# Altium schematic sheet USB_Host_Hub.SchDoc: USB Host HUB
size A3; Project: STM32MP15-DISCO PI; Date: Not used; ApprovedBy: Not used; CheckedBy: Not used; Author: Not used; CompanyName: STMicroelectronics; DrawnBy: Not used; Engineer: Not used; Organization: Not used; Address1: Not used; Address2: Not used; Address3: Not used; Address4: Not used; DocumentNumber: 12; Revision: Not used; SheetNumber: 12; SheetTotal: 17; CurrentTime: Not used; CurrentDate: Not used; Time: Not used; DocumentFullPathAndName: Not used; DocumentName: Not used; ModifiedDate: Not used; ImagePath: Not used; ProjectName: Not used; Application_BuildNumber: Not used
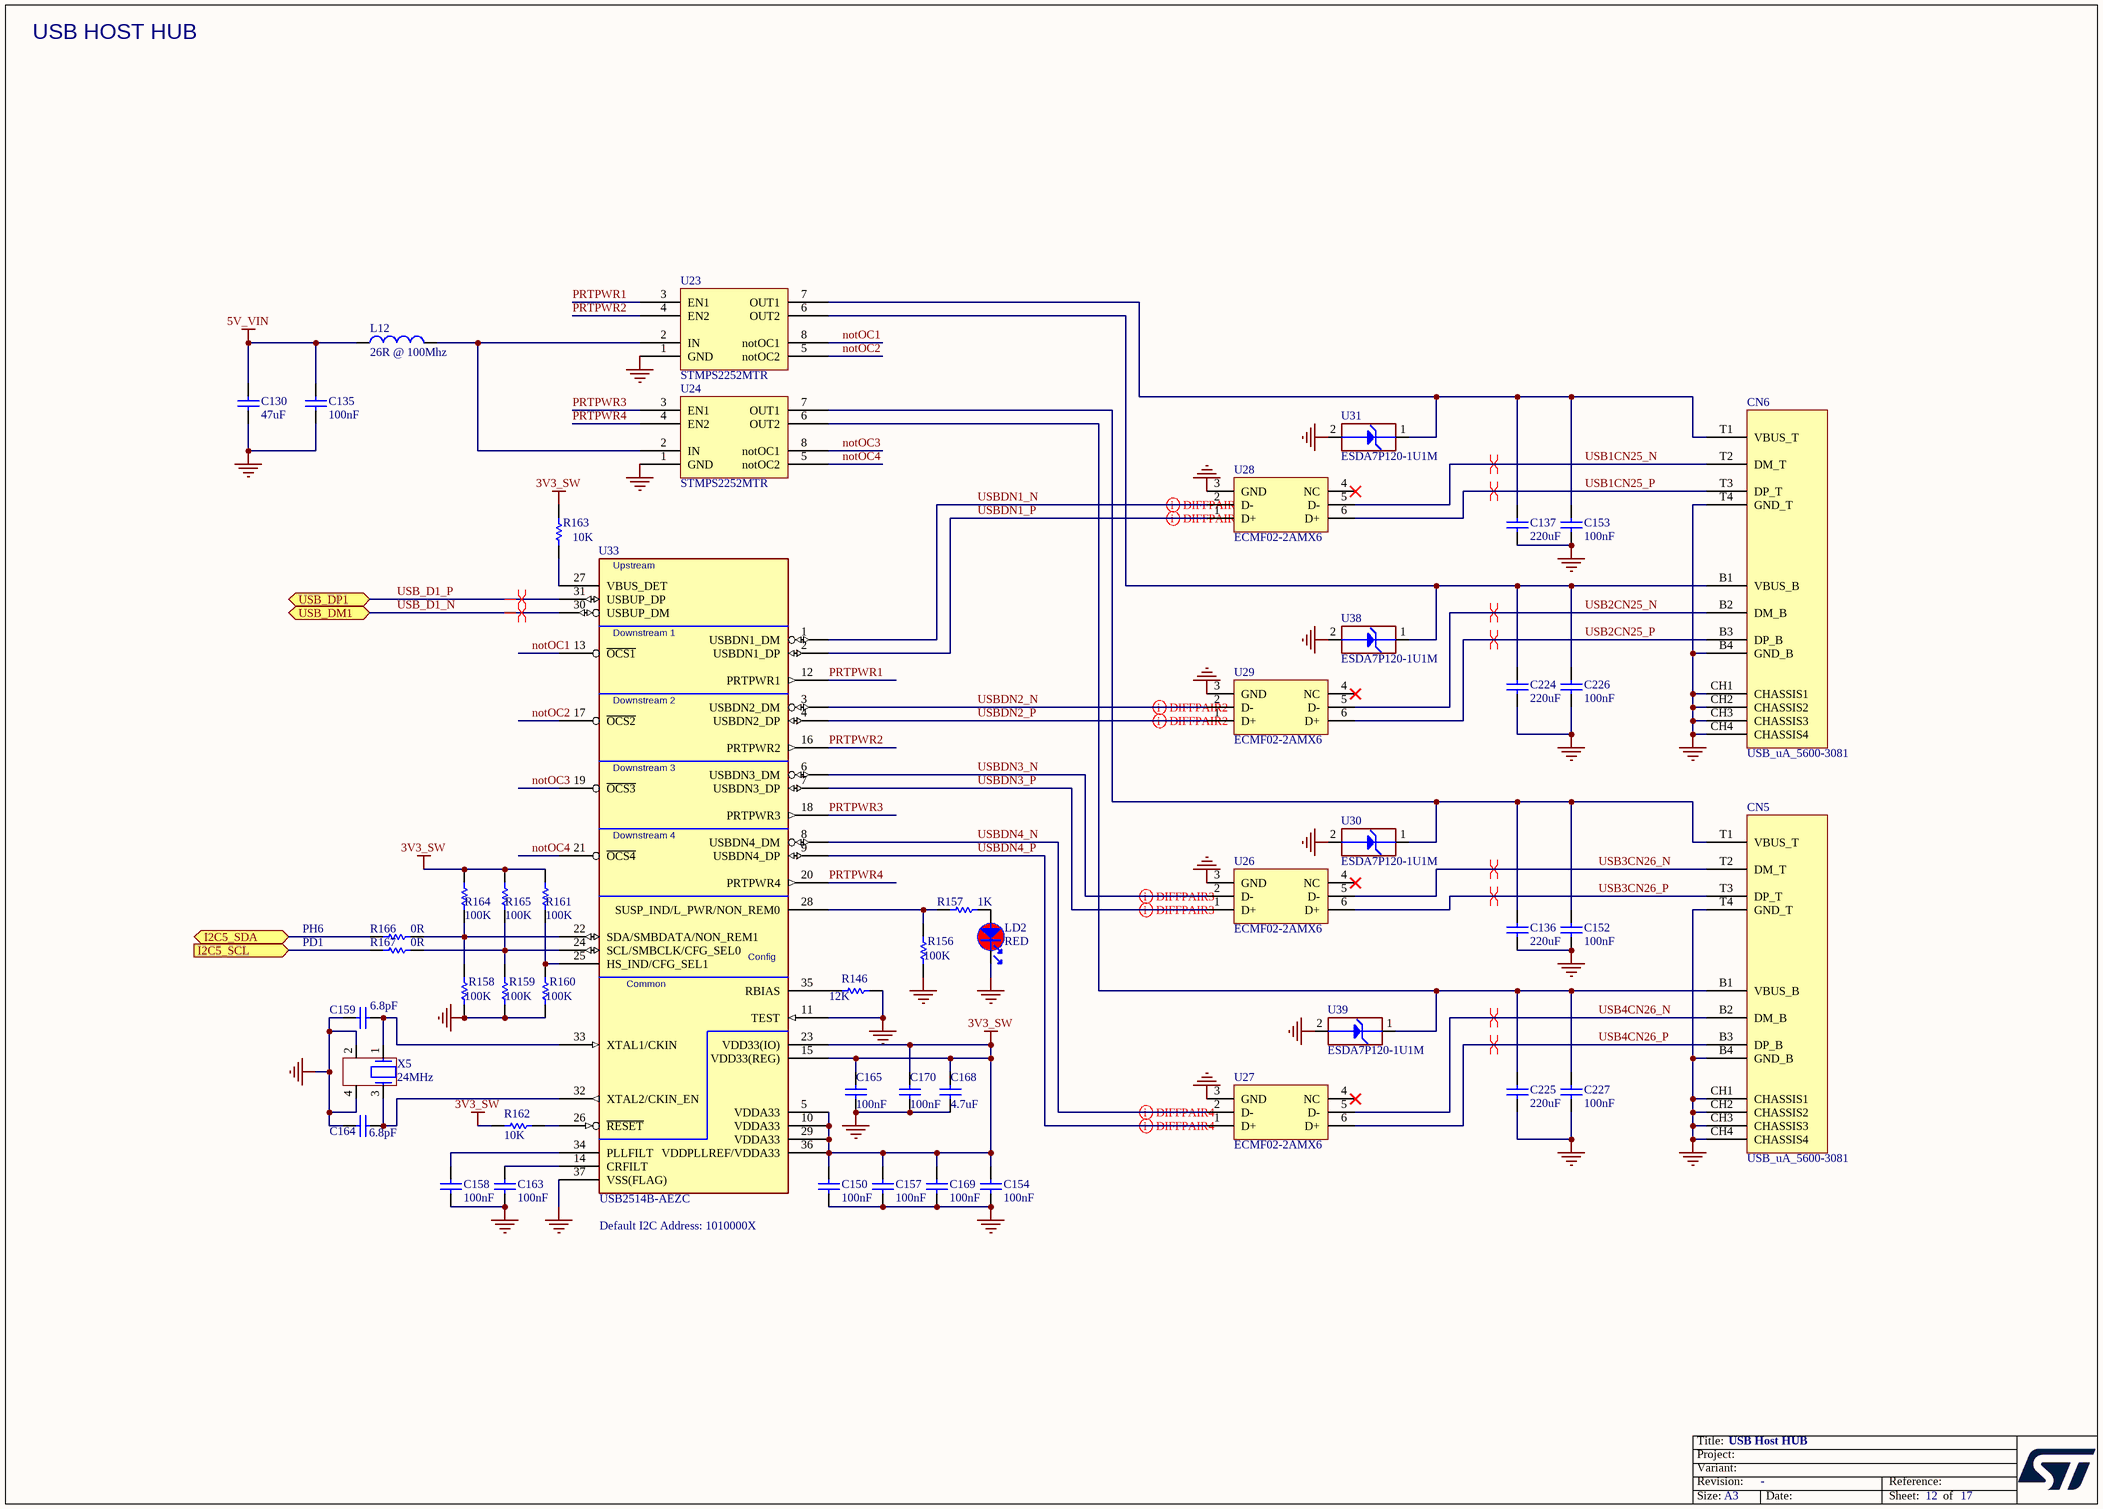
[diagram p0: USB_Host_Hub.SchDoc]

## Parts
C130  value 47uF  [C1206_H1P6]  (hidden comment: Capacitor)
C135  value 100nF  [C0402]  (hidden comment: Capacitor)
C136  value 220uF  [C1206_H1P6]  (hidden comment: Capacitor)
C137  value 220uF  [C1206_H1P6]  (hidden comment: Capacitor)
C150  value 100nF  [C0402]  (hidden comment: Capacitor)
C152  value 100nF  [C0402]  (hidden comment: Capacitor)
C153  value 100nF  [C0402]  (hidden comment: Capacitor)
C154  value 100nF  [C0402]  (hidden comment: Capacitor)
C157  value 100nF  [C0402]  (hidden comment: Capacitor)
C158  value 100nF  [C0402]  (hidden comment: Capacitor)
C159  value 6.8pF  [C0402]  (hidden comment: Capacitor)
C163  value 100nF  [C0402]  (hidden comment: Capacitor)
C164  value 6.8pF  [C0402]  (hidden comment: Capacitor)
C165  value 100nF  [C0402]  (hidden comment: Capacitor)
C168  value 4.7uF  [C0402]  (hidden comment: Capacitor)
C169  value 100nF  [C0402]  (hidden comment: Capacitor)
C170  value 100nF  [C0402]  (hidden comment: Capacitor)
C224  value 220uF  [C1206_H1P6]  (hidden comment: Capacitor)
C225  value 220uF  [C1206_H1P6]  (hidden comment: Capacitor)
C226  value 100nF  [C0402]  (hidden comment: Capacitor)
C227  value 100nF  [C0402]  (hidden comment: Capacitor)
CN5  value USB_uA_5600-3081  [CON_DUAL-USB-TYPE-A_CONEXCON_5600-3081]  (hidden comment: USB_DUAL_TYPEA_5600-3081)
CN6  value USB_uA_5600-3081  [CON_DUAL-USB-TYPE-A_CONEXCON_5600-3081]  (hidden comment: USB_DUAL_TYPEA_5600-3081)
L12  value 26R @ 100Mhz  [FIL_0603_H0P65]  (hidden comment: BEAD)
LD2  value RED  [LED_0603_RED]  (hidden comment: LED_red)
R146  value 12K  [R0402]  (hidden comment: Resistor)
R156  value 100K  [R0402]  (hidden comment: Resistor)
R157  value 1K  [R0402]  (hidden comment: Resistor)
R158  value 100K  [R0402]  (hidden comment: Resistor)
R159  value 100K  [R0402]  (hidden comment: Resistor)
R160  value 100K  [R0402]  (hidden comment: Resistor)
R161  value 100K  [R0402]  (hidden comment: Resistor)
R162  value 10K  [R0402]  (hidden comment: Resistor)
R163  value 10K  [R0402]  (hidden comment: Resistor)
R164  value 100K  [R0402]  (hidden comment: Resistor)
R165  value 100K  [R0402]  (hidden comment: Resistor)
R166  value 0R  [R0402]  (hidden comment: Resistor)
R167  value 0R  [R0402]  (hidden comment: Resistor)
U23  STMPS2252MTR  [ICC_SO8_5X4_P127]
U24  STMPS2252MTR  [ICC_SO8_5X4_P127]
U26  ECMF02-2AMX6  [ESD_QFN-6L_1P7X1P5_P050]
U27  ECMF02-2AMX6  [ESD_QFN-6L_1P7X1P5_P050]
U28  ECMF02-2AMX6  [ESD_QFN-6L_1P7X1P5_P050]
U29  ECMF02-2AMX6  [ESD_QFN-6L_1P7X1P5_P050]
U30  value ESDA7P120-1U1M  [ESD_QFN1610_2N_1K_2A]  (hidden comment: ESD-TRANSIL)
U31  value ESDA7P120-1U1M  [ESD_QFN1610_2N_1K_2A]  (hidden comment: ESD-TRANSIL)
U33  USB2514B-AEZC  [ICC_QFN36-EPAD_6X6_P050]
U38  value ESDA7P120-1U1M  [ESD_QFN1610_2N_1K_2A]  (hidden comment: ESD-TRANSIL)
U39  value ESDA7P120-1U1M  [ESD_QFN1610_2N_1K_2A]  (hidden comment: ESD-TRANSIL)
X5  value 24MHz  [CRY_NX2016SA_4P]  (hidden comment: XTAL_4_PINS)

## Ports
I2C5_SCL (in), I2C5_SDA (bidir), USB_DM1 (bidir), USB_DP1 (bidir)

## Nets
3V3_SW: C150.2 C154.2 C157.2 C165.2 C168.2 C169.2 C170.2 R161.2 R162.1 R163.2 R164.2 R165.2 U33.5(VDDA33) U33.10(VDDA33) U33.15(VDD33(REG)) U33.23(VDD33(IO)) U33.29(VDDA33) U33.36(VDDPLLREF/VDDA33)
5V_VIN: C130.2 C135.2 L12.1
GND: C130.1 C135.1 C136.1 C137.1 C150.1 C152.1 C153.1 C154.1 C157.1 C158.1 C159.1 C163.1 C164.1 C165.1 C168.1 C169.1 C170.1 C224.1 C225.1 C226.1 C227.1 CN5.B4(GND_B) CN5.CH1(CHASSIS1) CN5.CH2(CHASSIS2) CN5.CH3(CHASSIS3) CN5.CH4(CHASSIS4) CN5.T4(GND_T) CN6.B4(GND_B) CN6.CH1(CHASSIS1) CN6.CH2(CHASSIS2) CN6.CH3(CHASSIS3) CN6.CH4(CHASSIS4) CN6.T4(GND_T) LD2.2 R146.1 R156.1 R158.1 R159.1 R160.1 U23.1(GND) U24.1(GND) U26.3(GND) U27.3(GND) U28.3(GND) U29.3(GND) U30.2(GND) U31.2(GND) U33.11(TEST) U33.37(VSS(FLAG)) U38.2(GND) U39.2(GND) X5.2 X5.4
I2C5_SCL: R167.1 ; port I2C5_SCL
I2C5_SDA: R166.1 ; port I2C5_SDA
notOC1: U23.8(notOC1) U33.13(~{OCS1})
notOC2: U23.5(notOC2) U33.17(~{OCS2})
notOC3: U24.8(notOC1) U33.19(~{OCS3})
notOC4: U24.5(notOC2) U33.21(~{OCS4})
PRTPWR1: U23.3(EN1) U33.12(PRTPWR1)
PRTPWR2: U23.4(EN2) U33.16(PRTPWR2)
PRTPWR3: U24.3(EN1) U33.18(PRTPWR3)
PRTPWR4: U24.4(EN2) U33.20(PRTPWR4)
USB1CN25_N: CN6.T2(DM_T) U28.5(D-)
USB1CN25_P: CN6.T3(DP_T) U28.6(D+)
USB2CN25_N: CN6.B2(DM_B) U29.5(D-)
USB2CN25_P: CN6.B3(DP_B) U29.6(D+)
USB3CN26_N: CN5.T2(DM_T) U26.5(D-)
USB3CN26_P: CN5.T3(DP_T) U26.6(D+)
USB4CN26_N: CN5.B2(DM_B) U27.5(D-)
USB4CN26_P: CN5.B3(DP_B) U27.6(D+)
USB_D1_N: U33.30(USBUP_DM) ; port USB_DM1
USB_D1_P: U33.31(USBUP_DP) ; port USB_DP1
USBDN1_N: U28.2(D-) U33.1(USBDN1_DM)
USBDN1_P: U28.1(D+) U33.2(USBDN1_DP)
USBDN2_N: U29.2(D-) U33.3(USBDN2_DM)
USBDN2_P: U29.1(D+) U33.4(USBDN2_DP)
USBDN3_N: U26.2(D-) U33.6(USBDN3_DM)
USBDN3_P: U26.1(D+) U33.7(USBDN3_DP)
USBDN4_N: U27.2(D-) U33.8(USBDN4_DM)
USBDN4_P: U27.1(D+) U33.9(USBDN4_DP)
NetC136_2: C136.2 C152.2 CN5.T1(VBUS_T) U24.7(OUT1) U30.1(IO1)
NetC137_2: C137.2 C153.2 CN6.T1(VBUS_T) U23.7(OUT1) U31.1(IO1)
NetC158_2: C158.2 U33.34(PLLFILT)
NetC159_2: C159.2 U33.33(XTAL1/CKIN) X5.1
NetC163_2: C163.2 U33.14(CRFILT)
NetC164_2: C164.2 U33.32(XTAL2/CKIN_EN) X5.3
NetC224_2: C224.2 C226.2 CN6.B1(VBUS_B) U23.6(OUT2) U38.1(IO1)
NetC225_2: C225.2 C227.2 CN5.B1(VBUS_B) U24.6(OUT2) U39.1(IO1)
NetL12_2: L12.2 U23.2(IN) U24.2(IN)
NetLD2_1: LD2.1 R157.1
NetR146_2: R146.2 U33.35(RBIAS)
NetR156_2: R156.2 R157.2 U33.28(SUSP_IND/L_PWR/NON_REM0)
NetR158_2: R158.2 R164.1 R166.2 U33.22(SDA/SMBDATA/NON_REM1)
NetR159_2: R159.2 R165.1 R167.2 U33.24(SCL/SMBCLK/CFG_SEL0)
NetR160_2: R160.2 R161.1 U33.25(HS_IND/CFG_SEL1)
NetR162_2: R162.2 U33.26(~{RESET})
NetR163_1: R163.1 U33.27(VBUS_DET)

Not connected (* = marked no-connect by the designer): U26 4(NC)*; U27 4(NC)*; U28 4(NC)*; U29 4(NC)*

## Layout directives
differential pair: USB1CN25_N, USB1CN25_P, USB2CN25_N, USB2CN25_P, USB3CN26_N, USB3CN26_P, USB4CN26_N, USB4CN26_P, USB_D1_N, USB_D1_P, USBDN1_N, USBDN1_P, USBDN2_N, USBDN2_P, USBDN3_N, USBDN3_P, USBDN4_N, USBDN4_P

## Notes on the sheet
- USB HOST HUB
- PH6
- PD1
- Default I2C Address: 1010000X
- Title:
- Project:
- Size:
- Revision:
- Variant:
- A3
- -
- Date:
- Reference:
- Sheet:
- of
- (in symbol MCD-00145) Upstream; Downstream 1; Downstream 2; Downstream 3; Downstream 4; Config; Common

## Library data of the parts
C130 = MCD-02263: Capacitor, MLCC, 47uF, 25V, X5R, 20%, 1206, T=1.6mm; Part_Preference: Recommended; Manufacturer: MURATA; Manufacturer_Part_Number: GRM31CR61E476ME44; Component_Country_Of_Origin: Japan; ShowFields: YES; ID: 4363; Internal_Part_Number: MCD-02263; Status: Released; Part_Type: Capacitor; Package: C1206; ComponentLink1URL: http://tunmcdsvn.tun.st.com/Component_Datasheet_Library/Trunk/Capacitors/MURATA_Capacitor_GRM_series/MURATA_GRM_Datasheet.pdf; Order_Code_Digikey: 490-16268-2-ND; Order_Code_Farnell: N/A; Order_Code_RS: N/A
C135 C150 C152-C154 C157 C158 C163 C165 C169 C170 C226 C227 = MCD-00006: Capacitor, MLCC, 100nF, 16V, X7R, +/-10%, 0402, T=0.5mm; Manufacturer_Part_Number: CC0402KRX7R7BB104; Manufacturer: YAGEO; Part_Preference: Recommended; Order_Code_RS: 616-9701; Component_Country_Of_Origin: China; ShowFields: YES; ID: 2474; Internal_Part_Number: MCD-00006; Status: Released; Part_Type: Capacitor; Package: 0402; ComponentLink1URL: http://tunmcdsvn.tun.st.com/Component_Documentation_Library/Trunk/Capacitor/YAGEO_X7R_Series; Order_Code_Digikey: 311-1338-1-ND; Order_Code_Farnell: 9402047
C136 C137 C224 C225 = MCD-00104: Capacitor, MLCC, 220uF, 6V3, X5R, +/-20%, 1206, T=1.6mm; Manufacturer_Part_Number: GRM31CR60J227ME11; Manufacturer: MURATA; Part_Preference: Recommended; Order_Code_RS: 170-6396; Component_Country_Of_Origin: Japan; ShowFields: YES; ID: 2764; Internal_Part_Number: MCD-00104; Status: Released; Part_Type: Capacitor; Package: 1206; ComponentLink1URL: http://tunmcdsvn.tun.st.com/Component_Documentation_Library/Trunk/Capacitor/MURATA_GRM_Series; Order_Code_Digikey: 490-13970-1-ND; Order_Code_Farnell: 2494472
C159 C164 = MCD-00674: Capacitor, MLCC, 6.8pF, 50V, NPO, +/-0.25pF, 0402, T=0.5mm; Manufacturer_Part_Number: CC0402CRNPO9BN6R8; Manufacturer: YAGEO; Part_Preference: Recommended; Component_Country_Of_Origin: China; ShowFields: YES; ID: 3068; Internal_Part_Number: MCD-00674; Status: Released; Part_Type: Capacitor; Package: 0402; ComponentLink1URL: http://tunmcdsvn.tun.st.com/Component_Documentation_Library/Trunk/Capacitor/YAGEO_NP0_Series; Order_Code_Digikey: 311-3327-1-ND; Order_Code_Farnell: N/A; Order_Code_RS: N/A
C168 = MCD-01356: Capacitor, MLCC, 4.7uF, 6V3, X5R, +/-20%, 0402, T=0.5mm; Manufacturer_Part_Number: GRM155R60J475ME47; Manufacturer: MURATA; Part_Preference: Recommended; Order_Code_RS: 814-5230; Component_Country_Of_Origin: Japan; ShowFields: YES; ID: 3456; Internal_Part_Number: MCD-01356; Status: Released; Part_Type: Capacitor; Package: 0402; ComponentLink1URL: http://tunmcdsvn.tun.st.com/Component_Documentation_Library/Trunk/Capacitor/MURATA_GRM_Series; Order_Code_Digikey: 490-5915-1-ND; Order_Code_Farnell: 2666407
CN5 CN6 = MCD-00109: USB_Dual-TypeA, Receptacle, 8pins, 2.5mm, RA, TH, T= 15.5mm; Manufacturer: CONEXCON; Part_Type: Connector; Part_Preference: Recommended; Component_Country_Of_Origin: Unknown; ShowFields: YES; ID: 2756; Internal_Part_Number: MCD-00109; Manufacturer_Part_Number: 5600-3081; Status: Released; ComponentLink1URL: http://tunmcdsvn.tun.st.com/Component_Documentation_Library/Trunk/Connector/CONEXCON_5600_Series/; Order_Code_Digikey: N/A; Order_Code_Farnell: N/A; Order_Code_RS: N/A
L12 = MCD-00305: Ferrite bead, 26R @ 100Mhz, +/-25%, 6000mA, 0R007, 0603, T=0.75mm; Manufacturer_Part_Number: BLM18KG260TN1; Manufacturer: MURATA; Part_Type: Inductor; Part_Preference: Recommended; Order_Code_RS: 747-4723; Component_Country_Of_Origin: Japan; ShowFields: YES; ID: 2564; Internal_Part_Number: MCD-00305; Status: Checked; ComponentLink1URL: http://tunmcdsvn.tun.st.com/Component_Documentation_Library/Trunk/Inductor/MURATA_BLM_Series; Package: 0603; Order_Code_Digikey: 490-5252-2-ND; Order_Code_Farnell: 1781087
LD2 = MCD-00049: LED, Red, 0603; Manufacturer_Part_Number: 19-213-R6C-AP1Q2B/3T; Manufacturer: EVERLIGHT; Part_Type: Display; Part_Preference: Forbidden; Component_Country_Of_Origin: China; ShowFields: YES; ID: 2543; Internal_Part_Number: MCD-00049; Status: Obsolete; ComponentLink1URL: http://tunmcdsvn.tun.st.com/Component_Datasheet_Library/Trunk/Display/Everlight_SMD-LED-RED_19-213-R6C-AP1Q2B-3T-V3.doc; Package: LED 0603
R146 = MCD-00187: Resistor, 12K, 0402, +/-1%, 1/16W; Manufacturer_Part_Number: RC0402FR-0712KL; Manufacturer: YAGEO; BMS_Part_Number: 9131030; Part_Preference: Recommended; Component_Country_Of_Origin: China; ShowFields: YES; ID: 2678; Internal_Part_Number: MCD-00187; Status: Released; Part_Type: Resistor; ComponentLink1URL: http://tunmcdsvn.tun.st.com/Component_Documentation_Library/Trunk/Resistor/YAGEO_RC_L_Series; Package: 0402; Order_Code_Digikey: 311-12.0KLRCT-ND; Order_Code_Farnell: 9239367; Order_Code_RS: N/A
R156 R158-R161 R164 R165 = MCD-00059: Resistor, 100K, 0402, +/-1%, 1/16W; Manufacturer_Part_Number: RC0402FR-07100KL; Manufacturer: YAGEO; Part_Preference: Recommended; Component_Country_Of_Origin: China; ShowFields: YES; ID: 2533; Internal_Part_Number: MCD-00059; Status: Released; Part_Type: Resistor; ComponentLink1URL: http://tunmcdsvn.tun.st.com/Component_Documentation_Library/Trunk/Resistor/YAGEO_RC_L_Series; Package: 0402; Order_Code_Digikey: 311-100KLRTR-ND; Order_Code_Farnell: 2421891; Order_Code_RS: N/A
R157 = MCD-00061: Resistor, 1K, 0402, +/-1%,1/16W; Manufacturer_Part_Number: RC0402FR-071KL; Manufacturer: YAGEO; Part_Preference: Recommended; Component_Country_Of_Origin: China; ShowFields: YES; ID: 2532; Internal_Part_Number: MCD-00061; Status: Released; Part_Type: Resistor; ComponentLink1URL: http://tunmcdsvn.tun.st.com/Component_Documentation_Library/Trunk/Resistor/YAGEO_RC_L_Series; Package: 0402; Order_Code_Digikey: 311-1.00KLRCT-ND; Order_Code_Farnell: 9239235; Order_Code_RS: N/A
R162 R163 = MCD-00053: Resistor, 10K, 0402, +/-1%, 1/16W; Manufacturer_Part_Number: RC0402FR-0710KL; Manufacturer: YAGEO; BMS_Part_Number: 9131590; Part_Preference: Recommended; Component_Country_Of_Origin: China; ShowFields: YES; ID: 2539; Internal_Part_Number: MCD-00053; Status: Released; Part_Type: Resistor; ComponentLink1URL: http://tunmcdsvn.tun.st.com/Component_Documentation_Library/Trunk/Resistor/YAGEO_RC_L_Series; Package: 0402; Order_Code_Digikey: 311-10.0KLRCT-ND; Order_Code_Farnell: 9239359; Order_Code_RS: N/A
R166 R167 = MCD-00052: Resistor, 0R, 0402, +/-5%, 1/16W; Part_Preference: Recommended; Manufacturer: YAGEO; Manufacturer_Part_Number: RC0402JR-070RL; Order_Code_RS: 618-5804; Component_Country_Of_Origin: China; ShowFields: YES; ID: 2540; Internal_Part_Number: MCD-00052; Status: Released; Part_Type: Resistor; Package: 0402; ComponentLink1URL: http://tunmcdsvn.tun.st.com/Component_Documentation_Library/Trunk/Resistor/YAGEO_RC_L_Series; Order_Code_Digikey: 311-0.0JRCT-ND; Order_Code_Farnell: 9232516RL
U23 U24 = MCD-00123: IC,Dual-Channel-Power-Switch,500mA,100mR,SO8; Manufacturer: STMICROELECTRONICS; BMS_Part_Number: 9159012; Part_Preference: Recommended; Manufacturer_HQ_COO: EU; Component_Country_Of_Origin: China; ShowFields: YES; ID: 2746; Value: STMPS2252MTR; Internal_Part_Number: MCD-00123; Manufacturer_Part_Number: STMPS2252MTR; Status: Released; Part_Type: IC; ComponentLink1URL: http://tunmcdsvn.tun.st.com/Component_Datasheet_Library/Trunk/IC/STM_PWR_switch_STMPS2252MTR; Order_Code_Digikey: N/A; Order_Code_Farnell: N/A; Order_Code_RS: N/A
U26-U29 = MCD-00649: Common mode filter with ESD protection for USB 2.0 interface; Part_Type: Diode; Manufacturer: STMICROELECTRONICS; BMS_Part_Number: 9151138; Part_Preference: Recommended; Manufacturer_HQ_COO: EU; Component_Country_Of_Origin: China; ShowFields: YES; ID: 3094; Internal_Part_Number: MCD-00649; Value: ECMF02-2AMX6; Status: Released; Manufacturer_Part_Number: ECMF02-2AMX6; ComponentLink1URL: http://tunmcdsvn.tun.st.com/Component_Datasheet_Library/Trunk/Diodes/STM_ESD_ECMF02-2AMX6
U30 U31 U38 U39 = MCD-01026: High power transient voltage suppressor; Part_Type: Diode; Manufacturer: STMICROELECTRONICS; BMS_Part_Number: 9179046; Part_Preference: Recommended; Manufacturer_HQ_COO: EU; Component_Country_Of_Origin: China; ShowFields: YES; ID: 2997; Internal_Part_Number: MCD-01026; Status: Released; Manufacturer_Part_Number: ESDA7P120-1U1M; Package: QFN1610; ComponentLink1URL: http://tunmcdsvn.tun.st.com/Component_Datasheet_Library/Trunk/Diodes/STM_ESD_ESDA7P120-1U1M
U33 = MCD-00145: USB HUB 2,0 Controller; Manufacturer: MICROCHIP; Part_Type: IC; Part_Preference: Recommended; Component_Country_Of_Origin: Unknown; ShowFields: YES; ID: 2724; Value: USB2514B-AEZC; Internal_Part_Number: MCD-00145; Manufacturer_Part_Number: USB2514B-AEZC; Status: Released; ComponentLink1URL: http://tunmcdsvn.tun.st.com/Component_Datasheet_Library/Trunk/IC/Microchip_HS Hub Controller_USB2514B-AEZC; Order_Code_Digikey: N/A; Order_Code_Farnell: N/A; Order_Code_RS: N/A
X5 = MCD-01036: Crystal, 24MHz, 6pF, +/-20ppm, 80R, 2x1.6mm; Part_Type: Crystal_Osc; Manufacturer_Part_Number: NX2016SA-24MHZ-EXS00A-CS10820; Manufacturer: NDK; BMS_Part_Number: 9157045; Part_Preference: Recommended; Component_Country_Of_Origin: Unknown; ShowFields: YES; ID: 2989; Internal_Part_Number: MCD-01036; Status: Released; Package: 2x1.6mm; ComponentLink1URL: http://tunmcdsvn.tun.st.com/Component_Documentation_Library/Trunk/Crytal_Oscillator/NDK_NX2016SA_Series; Order_Code_Digikey: 644-1365; Order_Code_Farnell: N/A; Order_Code_RS: N/A